# Altium schematic sheet nrf51822_dev_dongle_interfaces.SchDoc: pca10000 Interfaces
size A4; Revision: 2.0.0; SheetNumber: 3; SheetTotal: 3; DrawnBy: RUBR; ProjectNumber: 4393; PCBRevision: 0100RUBR; DocumentSize: A4; PCAName: PCA10000; PCBNumber: 400003; ProjectName: Echelon
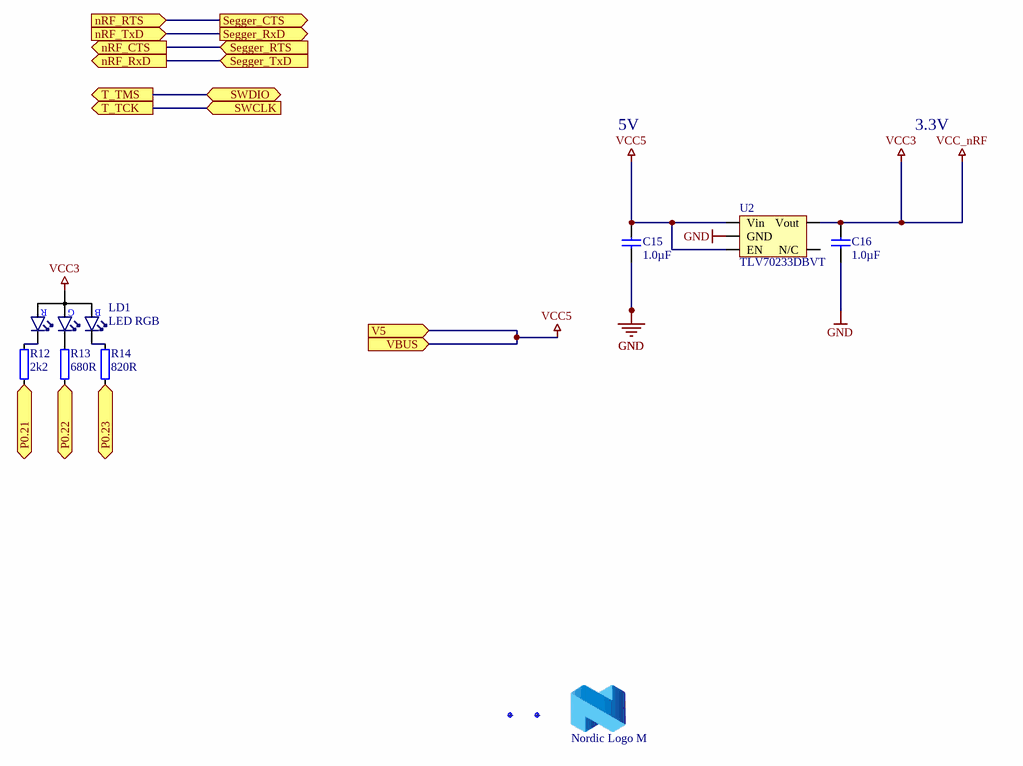
[diagram p0: nrf51822_dev_dongle_interfaces.SchDoc]

## Parts
C15  1.0µF  [CAPC1608X06L]
C16  1.0µF  [CAPC1608X06L]
Fid1  Fiducial mark  [Fiducial]  (value not drawn)
Fid2  Fiducial mark  [Fiducial]  (value not drawn)
LD1  LED RGB  [SML-LX0404SIUPGUSB]
LOGO1  Nordic Logo M  [NORDIC_LOGO_M]  (no BOM)
R12  2k2  [RESC1005X04L]
R13  680R  [RESC1005X04L]
R14  820R  [RESC1005X04L]
U2  TLV70233DBVT  [SOT-23-5]

## Ports
nRF_CTS (out), nRF_RTS (in), nRF_RxD (out), nRF_TxD (in), P0.21 (bidir), P0.22 (bidir), P0.23 (bidir), Segger_CTS (out), Segger_RTS (in), Segger_RxD (out), Segger_TxD (in), SWCLK (in), SWDIO (bidir), T_TCK (out), T_TMS (out), V5 (in), VBUS (in)

## Nets
GND: C15.1 C16.1 U2.2(GND)
VCC3: C16.2 LD1.4(A) U2.5(Vout)  [also labelled VCC_nRF]
VCC5: C15.2 U2.1(Vin) U2.3(EN) ; port V5, port VBUS
nRF_CTS: port Segger_RTS, port nRF_CTS
nRF_RTS: port Segger_CTS, port nRF_RTS
nRF_RxD: port Segger_TxD, port nRF_RxD
nRF_TxD: port Segger_RxD, port nRF_TxD
P0.21: R12.1 ; port P0.21
P0.22: R13.1 ; port P0.22
P0.23: R14.1 ; port P0.23
SWCLK: port T_TCK, port SWCLK
SWDIO: port T_TMS, port SWDIO
NetLD1_1: LD1.1(C_RED) R12.2
NetLD1_2: LD1.2(C_GREEN) R13.2
NetLD1_3: LD1.3(C_BLUE) R14.2

Not connected (* = marked no-connect by the designer): U2 4(N/C)

## Notes on the sheet
- 5V
- 3.3V
- Title
- Size
- Date:
- Project Number
- Sheet         of
- Revision
- File:
- Drawn By:
- (in symbol SML-LX0404SIUPGUSB) R; G; B

## Library data of the parts
C15 C16 = C0603-1µ0: Capacitor, X5R, ±10%; Note: 10V; Artikkelnr Noca: 20039205; Published: 2009-05-08; LatestRevisionDate: 2009-11-23; Publisher: Nordic Semiconductor; Value: 1.0µF; Part Number: C0603-1µ0; Manufacturer: *; Manufacturer Part Number: *; Datasheet: *; Footprint: 0603; Pin Count: 2; Supplier: *; Supplier part number: *; 2nd source Supplier: *; 2nd source part number: *
Fid1 Fid2 = Fid-Mark: Artikkelnr Noca: N.A.; Part Number: Fid-Mark; Manufacturer: *; Manufacturer Part Number: *; Datasheet: *; LatestRevisionDate: 2009-12-12; Pin Count: 1; Publisher: Nordic Semiconductor; Published: 2009-12-12; Value: *; Note: *; Supplier: *; Supplier part number: *; 2nd source Supplier: *; 2nd source part number: *
LD1 = SML-LX0404SIUPGUSB: RGB LED 1.00 mm x 1.00 mm SMD; Manufacturer: Lumex; 2nd source part number: 211-8843; Artikkelnr Noca: N.A.; Part Number: SML-LX0404SIUPGUSB; Manufacturer Part Number: SML-LX0404SIUPGUSB; Datasheet: http://media.digikey.com/pdf/Data%20Sheets/Lumex%20PDFs/SML-LX0404SIUPGUSB.pdf; LatestRevisionDate: 2012-10-08; Pin Count: 4; Publisher: Nordic Semiconductor; Published: 2012-10-08; Value: LED RGB; Note: *; Supplier: Digi-Key; Supplier part number: 67-2125-1-ND; 2nd source Supplier: Farnell
LOGO1 = Nordic Logo M: Nordic Logo, medium size; Artikkelnr Noca: N.A.; Part Number: Nordic Logo M; Manufacturer: *; Manufacturer Part Number: *; Datasheet: *; LatestRevisionDate: 2010-02-18; Publisher: Nordic Semiconductor; Value: Nordic Logo M; Note: *; Supplier: *; Supplier part number: *; 2nd source Supplier: *; 2nd source part number: *; Pin Count: 2; Published: 2010-02-18
R12 = R0402-2k2: Resistor, ±1%, 0.063W; Note: Chip Res 1%; Artikkelnr Noca: 27049081; Part Number: R0402-2k2; Manufacturer: *; Manufacturer Part Number: *; Datasheet: *; Footprint: 0402; LatestRevisionDate: 2009-11-23; Pin Count: 2; Publisher: Nordic Semiconductor; Published: 2009-05-08; Value: 2k2; Supplier: Farnell; Supplier part number: 173-8854; 2nd source Supplier: *; 2nd source part number: *
R13 = R0402-680: Resistor, ±1%, 0.063W; Note: Chip Res 1%; Artikkelnr Noca: 27049069; Part Number: R0402-680; Manufacturer: *; Manufacturer Part Number: *; Datasheet: *; Footprint: 0402; LatestRevisionDate: 2009-11-23; Pin Count: 2; Publisher: Nordic Semiconductor; Published: 2009-05-08; Value: 680R; Supplier: Farnell; Supplier part number: 173-8848; 2nd source Supplier: *; 2nd source part number: *
R14 = R0402-820: Resistor, ±1%, 0.063W; Note: Chip Res 1%; Artikkelnr Noca: 27049071; Part Number: R0402-820; Manufacturer: *; Manufacturer Part Number: *; Datasheet: *; Footprint: 0402; LatestRevisionDate: 2009-11-23; Pin Count: 2; Publisher: Nordic Semiconductor; Published: 2009-05-08; Value: 820R; Supplier: Farnell; Supplier part number: 173-8849; 2nd source Supplier: *; 2nd source part number: *
U2 = TLV70233DBVT: IC REG LDO 3.3V 300MA SOT23-5; Manufacturer: Texas Instruments; Note: 300-mA, Low-IQ, Low-Dropout Regulator; Artikkelnr Noca: 17039215; Part Number: TLV70233DBVT; Manufacturer Part Number: TLV70233DBVT; Datasheet: http://www.ti.com/lit/ds/symlink/tlv70218.pdf; LatestRevisionDate: 2012-07-06; Pin Count: 5; Publisher: Nordic Semiconductor; Published: 2012-07-06; Value: TLV70233DBVT; Supplier: Digi-Key; Supplier part number: 296-27895-1-ND; 2nd source Supplier: *; 2nd source part number: *